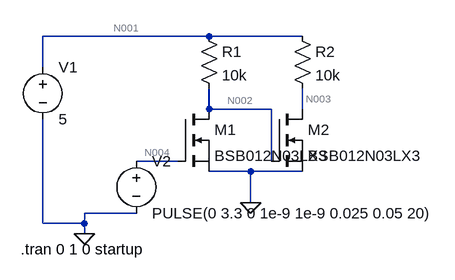
[diagram p0: schematic 3V3_to_5V_Converter_NMOS.asc]
3V3_to_5V_Converter_NMOS.asc, the LTspice schematic file:
Version 4
SHEET 1 880 680
WIRE 192 0 -64 0
WIRE 336 0 192 0
WIRE -64 48 -64 0
WIRE 192 112 192 80
WIRE 288 112 192 112
WIRE 336 112 336 80
WIRE 144 192 80 192
WIRE 288 192 288 112
WIRE 256 208 192 208
WIRE 336 208 256 208
WIRE 256 256 256 208
WIRE 80 272 0 272
WIRE -64 288 -64 128
WIRE 0 288 0 272
WIRE 0 288 -64 288
WIRE 0 304 0 288
FLAG 256 256 0
FLAG 0 304 0
SYMBOL nmos 144 112 R0
SYMATTR InstName M1
SYMATTR Value BSB012N03LX3
SYMBOL res 176 -16 R0
SYMATTR InstName R1
SYMATTR Value 10k
SYMBOL res 320 -16 R0
SYMATTR InstName R2
SYMATTR Value 10k
SYMBOL nmos 288 112 R0
SYMATTR InstName M2
SYMATTR Value BSB012N03LX3
SYMBOL voltage -64 32 R0
WINDOW 123 0 0 Left 0
WINDOW 39 0 0 Left 0
SYMATTR InstName V1
SYMATTR Value 5
SYMBOL voltage 80 176 R0
WINDOW 123 0 0 Left 0
WINDOW 39 0 0 Left 0
SYMATTR InstName V2
SYMATTR Value PULSE(0 3.3 0 1e-9 1e-9 0.025 0.05 20)
TEXT -98 328 Left 2 !.tran 0 1 0 startup

The netlist it stands for:
* 3V3_to_5V_Converter_NMOS.asc
M1 N002 N004 0 0 BSB012N03LX3
R1 N001 N002 10k
R2 N001 N003 10k
M2 N003 N002 0 0 BSB012N03LX3
V1 N001 0 5
V2 N004 0 PULSE(0 3.3 0 1e-9 1e-9 0.025 0.05 20)
.model NMOS NMOS
.model PMOS PMOS
.lib standard.mos
.tran 0 1 0 startup
.backanno
.end

* Results of the author's LTspice run, read from the files saved beside the schematic
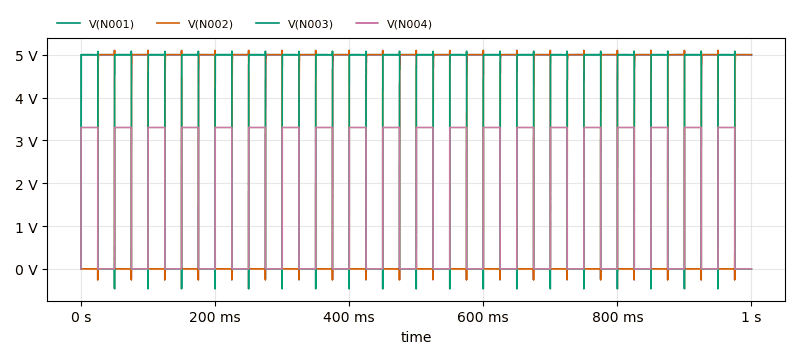
[diagram p1: Transient Analysis of 3V3_to_5V_Converter_NMOS.asc, plotted from the saved traces]
* Transient Analysis, 1 run:
*   V(N001): min 0 V, max 5 V, average 5 V, rms 5 V, last 5 V
*   V(N002): min -257.9 mV, max 5.102 V, average 2.479 V, rms 3.514 V, last 5 V
*   V(N003): min -466.3 mV, max 5.082 V, average 2.505 V, rms 3.537 V, last 604.3 nV
*   V(N004): min 0 V, max 3.3 V, average 1.65 V, rms 2.333 V, last 0 V